# EAGLE design psoc_module (EAGLE 4.16)
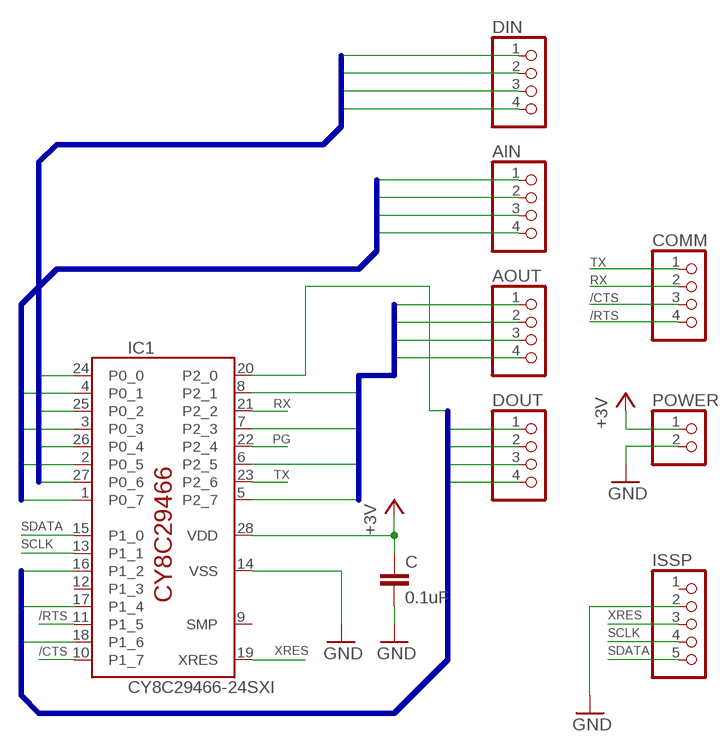
[diagram p0: schematic, sheet 1]

## Parts
AIN  PINHD-1X4  [1X04]
AOUT  PINHD-1X4  [1X04]
C  0.1uF  C-EUC2012  [C2012]
COMM  PINHD-1X4  [1X04]
DIN  PINHD-1X4  [1X04]
DOUT  PINHD-1X4  [1X04]
IC1  CY8C29466-24SXI  [SOIC28]
ISSP  PINHD-1X5  [1X05]
POWER  PINHD-1X2  [1X02]

## Nets
+3V: C.1 IC1.28(VDD) POWER.1
/CTS: COMM.3 IC1.10(P1_7)
/RTS: COMM.4 IC1.11(P1_5)
AIN0: DIN.1 IC1.27(P0_6)
AIN1: DIN.2 IC1.26(P0_4)
AIN2: DIN.3 IC1.25(P0_2)
AIN3: DIN.4 IC1.24(P0_0)
AOUT0: AOUT.1 IC1.5(P2_7)
AOUT1: AOUT.2 IC1.6(P2_5)
AOUT2: AOUT.3 IC1.7(P2_3)
AOUT3: AOUT.4 IC1.8(P2_1)
DIN0: AIN.1 IC1.1(P0_7)
DIN1: AIN.2 IC1.2(P0_5)
DIN2: AIN.3 IC1.3(P0_3)
DIN3: AIN.4 IC1.4(P0_1)
DOUT0: DOUT.1 IC1.20(P2_0)
DOUT1: DOUT.2 IC1.18(P1_6)
DOUT2: DOUT.3 IC1.17(P1_4)
DOUT3: DOUT.4 IC1.16(P1_2)
GND: C.2 IC1.14(VSS) ISSP.2 POWER.2
PG: IC1.22(P2_4)
RX: COMM.2 IC1.21(P2_2)
SCLK: IC1.13(P1_1) ISSP.4
SDATA: IC1.15(P1_0) ISSP.5
TX: COMM.1 IC1.23(P2_6)
XRES: IC1.19(XRES) ISSP.3
Unconnected: IC1.9(SMP) IC1.12(P1_3) ISSP.1

## Buses
AIN[0..3]
DIN[0..3]
AOUT[0..3]
DOUT[0..3]

## Library data of the parts
AIN AOUT COMM DIN DOUT = pinhead:PINHD-1X4: PIN HEADER
C = rcl:C-EU: CAPACITOR, European symbol
IC1 = cypress_psoc:CY8C29466-24*: PSoC Mixed-Signal Array CY8C29466-24PXI (DIP) CY8C29466-24SXI (SOIC) CY8C29466-24PVXI (SSOP)
ISSP = pinhead:PINHD-1X5: PIN HEADER
POWER = pinhead:PINHD-1X2: PIN HEADER

## Board
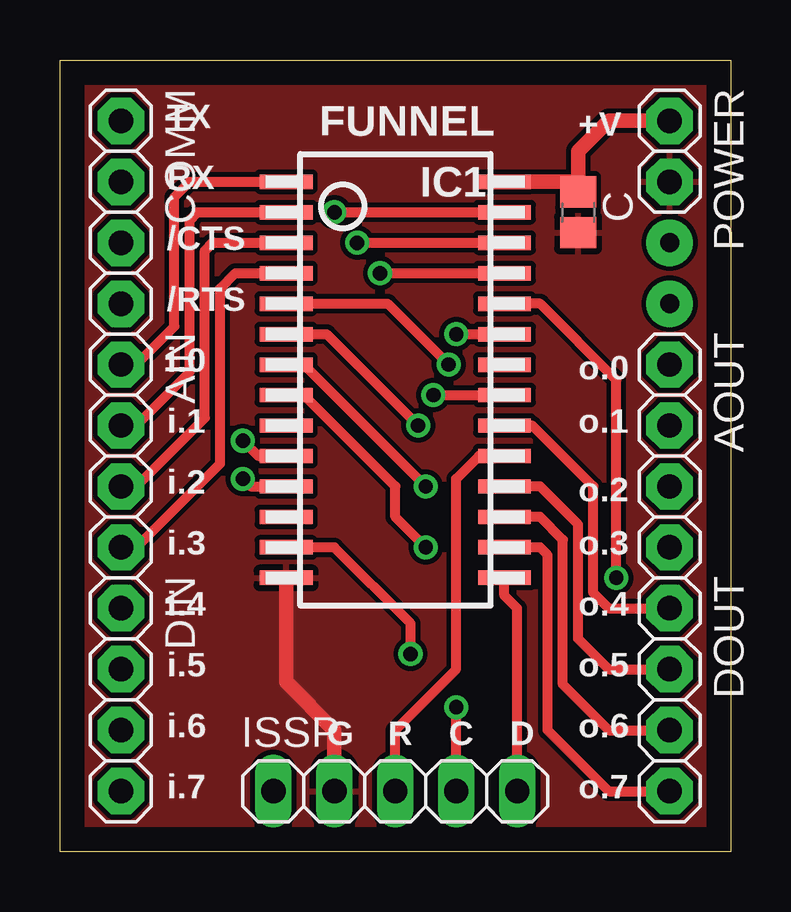
[diagram p1: board, top side]
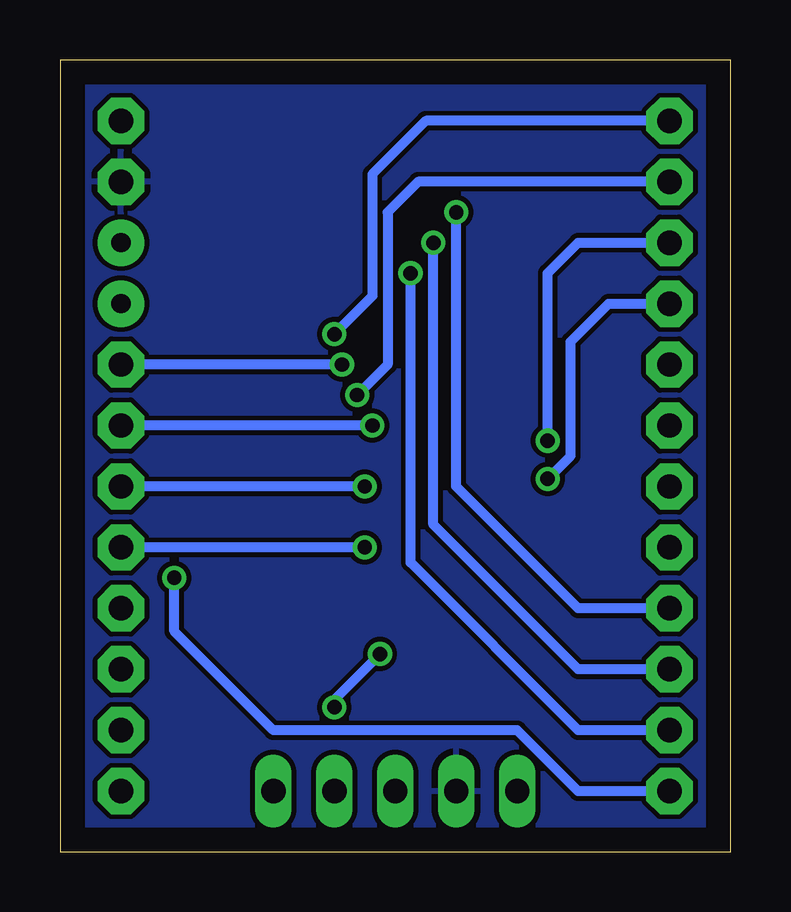
[diagram p2: board, bottom side, seen from below]

Size 27.94 x 33.02 mm. Coordinates in mm from the lower left corner, seen from the top.
Outline: 0,0 0,33.02 27.94,33.02 27.94,0 0,0
Copper layers (1*16): Top 0.035mm / dielectric 1.5mm / Bottom 0.035mm
Design rules "8mils": minimum track width 10mil, minimum drill 24mil, track to track 8mil, track to pad 8mil, pad to pad 8mil, via to via 8mil, smd to smd 8mil, copper to edge 40mil, drill to drill 10mil, minimum pad ring 10mil, minimum via ring 8mil, stop-mask expansion 0mil, vias tented up to drill 0mil, thermal gap 10mil

### Footprints (pad centres in the part's own frame; a part is rotated, then mirrored left to right if it is on the bottom)
1X04 = drill 1.016 pad 1.93 octagon: 1 -3.81,0; 2 -1.27,0; 3 1.27,0; 4 3.81,0
C2012 = smd 1.3 x 1.5: 1 -0.85,0; 2 0.85,0
SOIC28 = smd 0.6 x 2.2: 1 8.89,4.548; 2 7.62,4.548; 3 6.35,4.548; 4 5.08,4.548; 5 3.81,4.548; 6 2.54,4.548; 7 1.27,4.548; 8 0,4.548; 9 -1.27,4.548; 10 -2.54,4.548; 11 -3.81,4.548; 12 -5.08,4.548; 13 -6.35,4.548; 14 -7.62,4.548; 15 -7.62,-4.548; 16 -6.35,-4.548; 17 -5.08,-4.548; 18 -3.81,-4.548; 19 -2.54,-4.548; 20 -1.27,-4.548; 21 0,-4.548; 22 1.27,-4.548; 23 2.54,-4.548; 24 3.81,-4.548; 25 5.08,-4.548; 26 6.35,-4.548; 27 7.62,-4.548; 28 8.89,-4.548
1X05 = drill 1.016 long: 1 -5.08,0; 2 -2.54,0; 3 0,0; 4 2.54,0; 5 5.08,0
1X02 = drill 1.016 pad 1.93 octagon: 1 -1.27,0; 2 1.27,0

### Placement (x,y rotation side)
AIN  2.54,16.51 270 top
AOUT  25.4,16.51 270 top
C  21.59,26.67 270 top
COMM  2.54,26.67 270 top
DIN  2.54,6.35 270 top
DOUT  25.4,6.35 270 top
IC1  13.97,19.05 90 top
ISSP  13.97,2.54 0 top
POWER  25.4,29.21 270 top

### Tracks (layer width: path | path; a pad name or v marks a point on that pad's centre or on a via)
+3V
  Top 0.406: 21.59,27.94 C.1 | IC1.28 18.41,27.94
  Top 0.61: POWER.1 22.86,30.48 21.59,29.21 21.59,27.94 IC1.28
/CTS  (via drill 0.6)
  Top 0.406: IC1.10 8.26,16.51 v7.62,17.14
  Bottom 0.406: v7.62,17.14 7.62,24.13 6.35,25.4 COMM.3
/RTS  (via drill 0.6)
  Top 0.406: IC1.11 7.94,15.24 v7.62,15.56
  Bottom 0.406: v7.62,15.56 6.67,16.51 6.67,21.27 5.08,22.86 COMM.4
AIN0  (via drill 0.6)
  Top 0.406: v11.43,26.67 IC1.27
  Bottom 0.406: v11.43,26.67 11.43,15.24 6.35,10.16 DIN.1
AIN1  (via drill 0.6)
  Top 0.406: v12.38,25.4 IC1.26
  Bottom 0.406: v12.38,25.4 12.38,13.65 6.35,7.62 DIN.2
AIN2  (via drill 0.6)
  Top 0.406: v13.34,24.13 IC1.25
  Bottom 0.406: v13.34,24.13 13.34,12.07 6.35,5.08 DIN.3
AIN3  (via drill 0.6)
  Top 0.406: IC1.24 20,22.86 23.18,19.68 v23.18,11.43
  Bottom 0.406: v23.18,11.43 23.18,9.21 19.05,5.08 8.89,5.08 6.35,2.54 DIN.4
AOUT0  (via drill 0.6)
  Top 0.406: IC1.5 13.65,22.86 v16.19,20.32
  Bottom 0.406: v16.19,20.32 AOUT.1
AOUT1  (via drill 0.6)
  Top 0.406: IC1.6 11.11,21.59 v14.92,17.78
  Bottom 0.406: v14.92,17.78 AOUT.2
AOUT2  (via drill 0.6)
  Top 0.406: IC1.7 10.16,20.32 v15.24,15.24
  Bottom 0.406: v15.24,15.24 AOUT.3
AOUT3  (via drill 0.6)
  Top 0.406: IC1.8 10.16,19.05 13.97,15.24 13.97,13.97 v15.24,12.7
  Bottom 0.406: v15.24,12.7 AOUT.4
DIN0
  Top 0.406: IC1.1 5.4,27.94 4.76,27.3 4.76,21.91 3.18,20.32 AIN.1
DIN1
  Top 0.406: IC1.2 5.71,26.67 5.4,26.35 5.4,20 3.18,17.78 AIN.2
DIN2
  Top 0.406: IC1.3 6.35,25.4 6.03,25.08 6.03,18.1 3.18,15.24 AIN.3
DIN3
  Top 0.406: IC1.4 7.3,24.13 6.67,23.5 6.67,16.19 3.18,12.7 AIN.4
DOUT0
  Top 0.406: IC1.20 19.68,17.78 22.23,15.24 22.23,10.79 22.86,10.16 DOUT.1 25.08,9.84
DOUT1
  Top 0.406: IC1.18 20,15.24 21.59,13.65 21.59,8.89 22.86,7.62 DOUT.2 25.08,7.62
DOUT2
  Top 0.406: IC1.17 20,13.97 20.96,13.02 20.96,6.99 22.86,5.08 DOUT.3 25.08,5.08
DOUT3
  Top 0.406: IC1.16 20,12.7 20.32,12.38 20.32,5.08 22.86,2.54 DOUT.4 25.08,2.54
GND
  Top 0.61: IC1.14 9.42,7.09 11.43,5.08 ISSP.2
  pour Top: -1.27,34.29 29.21,34.29 29.21,-1.27 -1.27,-1.27
  pour Bottom: -2.54,35.56 30.48,35.56 30.48,-2.54 -2.54,-2.54
N$1  (via drill 0.8 pad 1.93)
  other vias: 25.4,25.4
N$2  (via drill 0.8 pad 1.93)
  other vias: 25.4,22.86
RX  (via drill 0.6)
  Top 0.406: v15.56,19.05 IC1.21
  Bottom 0.406: v15.56,19.05 14.29,20.32 14.29,26.67 13.02,27.94 COMM.2
SCLK  (via drill 0.6)
  Top 0.406: ISSP.4 v16.51,6.03 | v14.61,8.26 14.61,9.53 11.43,12.7 10.79,12.7 | 10.79,12.7 IC1.13 | IC1.13 8.89,12.7 | 10.79,12.7 IC1.13
  Bottom 0.406: v16.51,6.03 16.51,6.35 v14.61,8.26
SDATA
  Top 0.406: IC1.15 18.52,10.69 19.05,10.16 ISSP.5
TX  (via drill 0.6)
  Top 0.406: v16.51,21.59 IC1.23
  Bottom 0.406: v16.51,21.59 14.92,23.18 14.92,28.26 12.7,30.48 COMM.1
XRES
  Top 0.406: IC1.19 17.46,16.51 16.51,15.56 16.51,7.62 13.97,5.08 ISSP.3

### Text on the board
tNames: TX | FUNNEL | +V | RX | /CTS | /RTS | i.0 | o.0 | i.1 | o.1 | i.2 | o.2 | i.3 | o.3 | i.4 | o.4 | i.5 | o.5 | i.6 | G | R | C | D | o.6 | i.7 | o.7